# EAGLE design terrarium shield (EAGLE 6.5.0)
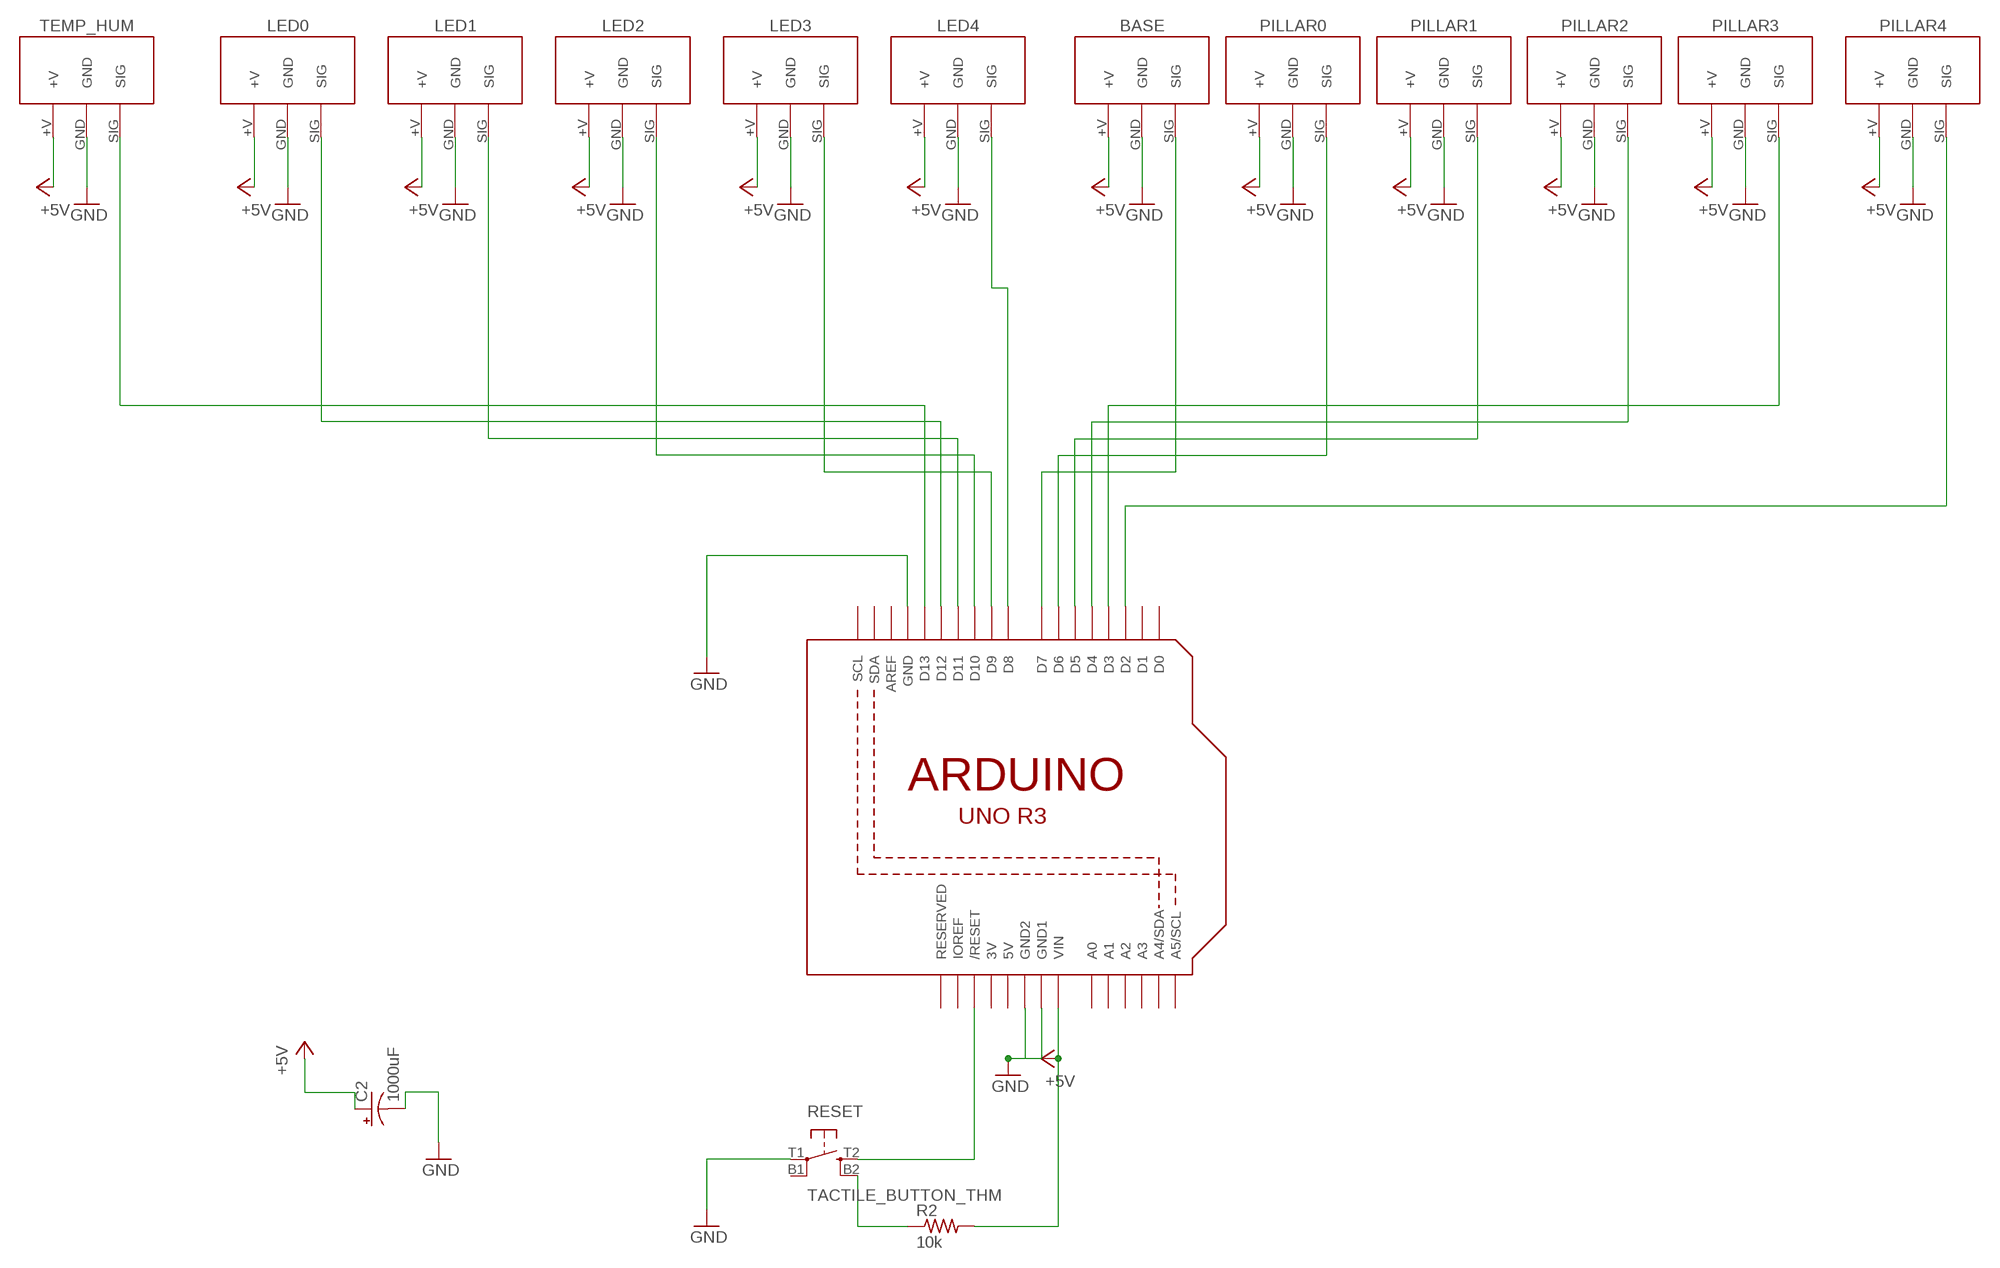
[diagram p0: schematic, sheet 1]

## Parts
BASE  MOLEX_3PIN_VERT_THM  [MOLEX_3PIN_VERT_THM]
C2  1000uF  CAP_POLPTH4  [CPOL-RADIAL-1000UF-25V]
LED0  MOLEX_3PIN_VERT_THM  [MOLEX_3PIN_VERT_THM]
LED1  MOLEX_3PIN_VERT_THM  [MOLEX_3PIN_VERT_THM]
LED2  MOLEX_3PIN_VERT_THM  [MOLEX_3PIN_VERT_THM]
LED3  MOLEX_3PIN_VERT_THM  [MOLEX_3PIN_VERT_THM]
LED4  MOLEX_3PIN_VERT_THM  [MOLEX_3PIN_VERT_THM]
PILLAR0  MOLEX_3PIN_VERT_THM  [MOLEX_3PIN_VERT_THM]
PILLAR1  MOLEX_3PIN_VERT_THM  [MOLEX_3PIN_VERT_THM]
PILLAR2  MOLEX_3PIN_VERT_THM  [MOLEX_3PIN_VERT_THM]
PILLAR3  MOLEX_3PIN_VERT_THM  [MOLEX_3PIN_VERT_THM]
PILLAR4  MOLEX_3PIN_VERT_THM  [MOLEX_3PIN_VERT_THM]
R2  10k  RESISTOR_US_THM  [RESISTOR_THM]
RESET  TACTILE_BUTTON_THM  [TACTILE_BUTTON_THM]
TEMP_HUM  MOLEX_3PIN_VERT_THM  [MOLEX_3PIN_VERT_THM]
U$1  ARDUINO_UNO_R3  [ARDUINO_UNO_R3]

## Nets
+5V [power]: BASE.+V C2.1(+) LED0.+V LED1.+V LED2.+V LED3.+V LED4.+V PILLAR0.+V PILLAR1.+V PILLAR2.+V PILLAR3.+V PILLAR4.+V R2.P$2 TEMP_HUM.+V U$1.VIN
GND [power]: BASE.GND C2.2(-) LED0.GND LED1.GND LED2.GND LED3.GND LED4.GND PILLAR0.GND PILLAR1.GND PILLAR2.GND PILLAR3.GND PILLAR4.GND RESET.T1 TEMP_HUM.GND U$1.GND U$1.GND1 U$1.GND2
N$1: R2.P$1 RESET.B2
N$2: TEMP_HUM.SIG U$1.D13
N$3: LED0.SIG U$1.D12
N$4: LED1.SIG U$1.D11
N$5: LED2.SIG U$1.D10
N$6: LED3.SIG U$1.D9
N$7: LED4.SIG U$1.D8
N$8: BASE.SIG U$1.D7
N$9: PILLAR0.SIG U$1.D6
N$10: PILLAR1.SIG U$1.D5
N$11: PILLAR2.SIG U$1.D4
N$12: PILLAR3.SIG U$1.D3
N$13: RESET.T2 U$1.RESET(/RESET)
N$15: PILLAR4.SIG U$1.D2
Unconnected: RESET.B1 U$1.A0 U$1.A1 U$1.A2 U$1.A3 U$1.A4(A4/SDA) U$1.A5(A5/SCL) U$1.AREF U$1.D0 U$1.D1 U$1.IOREF U$1.RESERVED U$1.SCL U$1.SDA

## Power pins joined to a net without a drawn wire
3V: U$1.3V
5V: U$1.5V

## Library data of the parts
BASE LED0 LED1-LED4 PILLAR0 PILLAR1-PILLAR4 TEMP_HUM = tjw:MOLEX_3PIN_VERT_THM: Starting on a device for the Molex 3pin vertical through-hole connectors I've ordered. Dimensions should be good, but pad placement just tossed in there.
C2 = SparkFun-Passives:CAP_POL: Capacitor Polarized These are standard SMD and PTH capacitors. Normally 10uF, 47uF, and 100uF in electrolytic and tantalum varieties. Always verify the external diameter of the through hole cap, it varies with capacity, voltage, and manufacturer. The EIA devices should be standard.
R2 = tjw:RESISTOR_US_THM: Basic through-hole resistor
RESET = tjw:TACTILE_BUTTON_THM
U$1 = tjw:ARDUINO_UNO_R3: Arduino Uno R3, copied from Adafruit library and border fixed to be in correct layer.

## Net classes
0 default: width 0.305 mm, drill 0.508 mm, clearance 0.305 mm
1 power: width 0.762 mm, drill 0.508 mm, clearance 0.508 mm

## Board
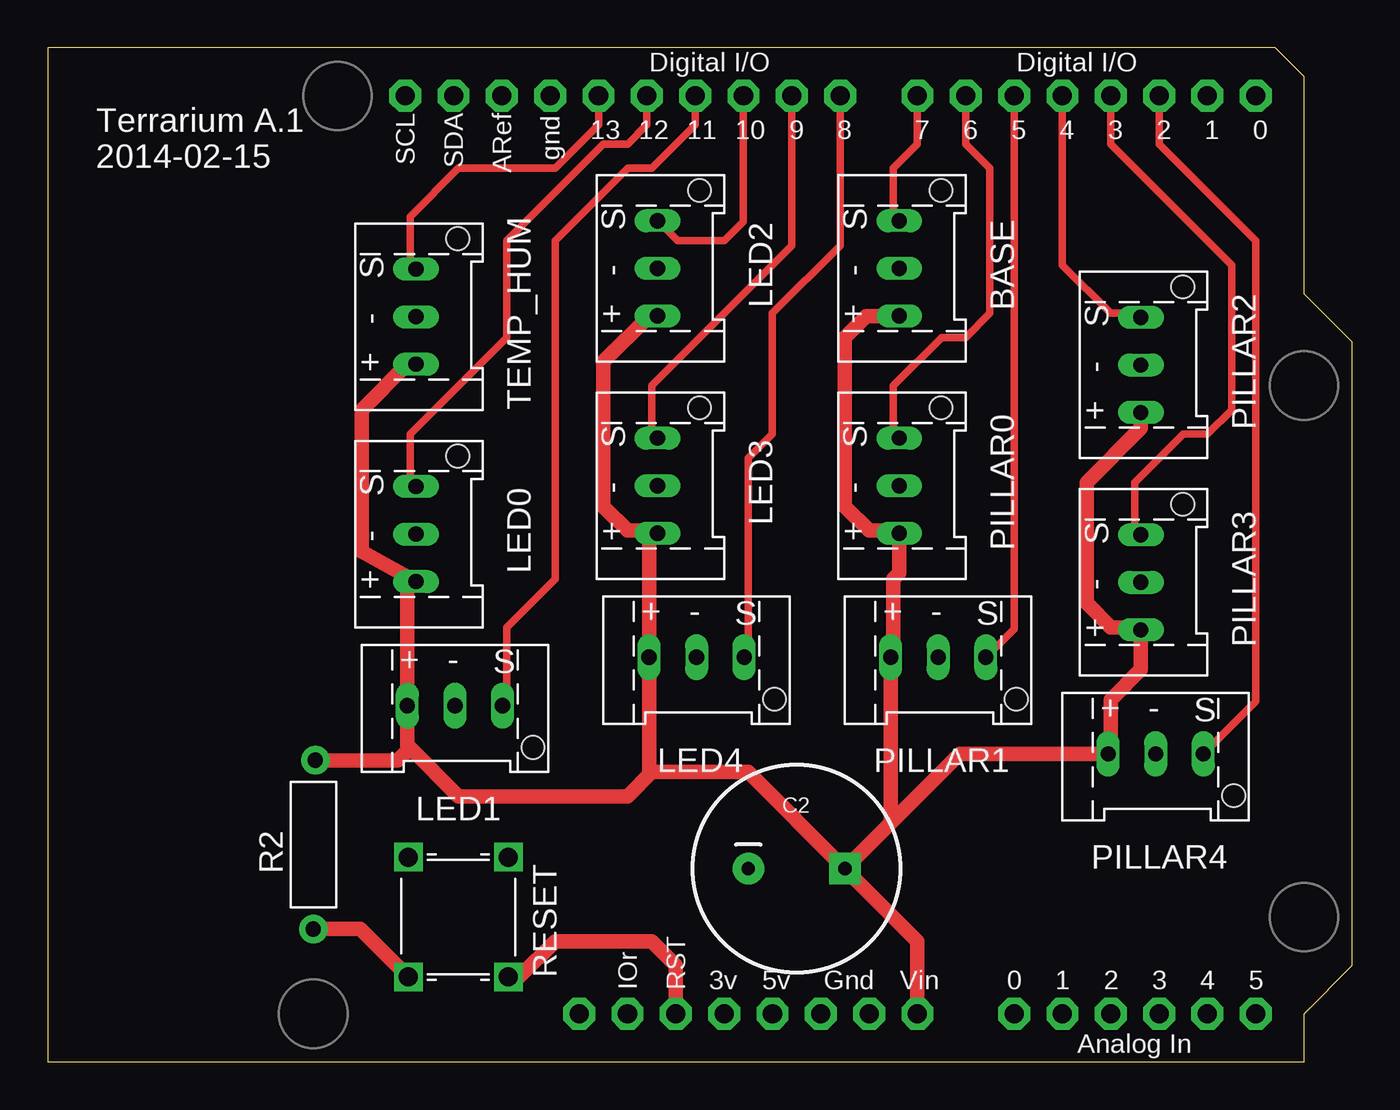
[diagram p1: board, top side]
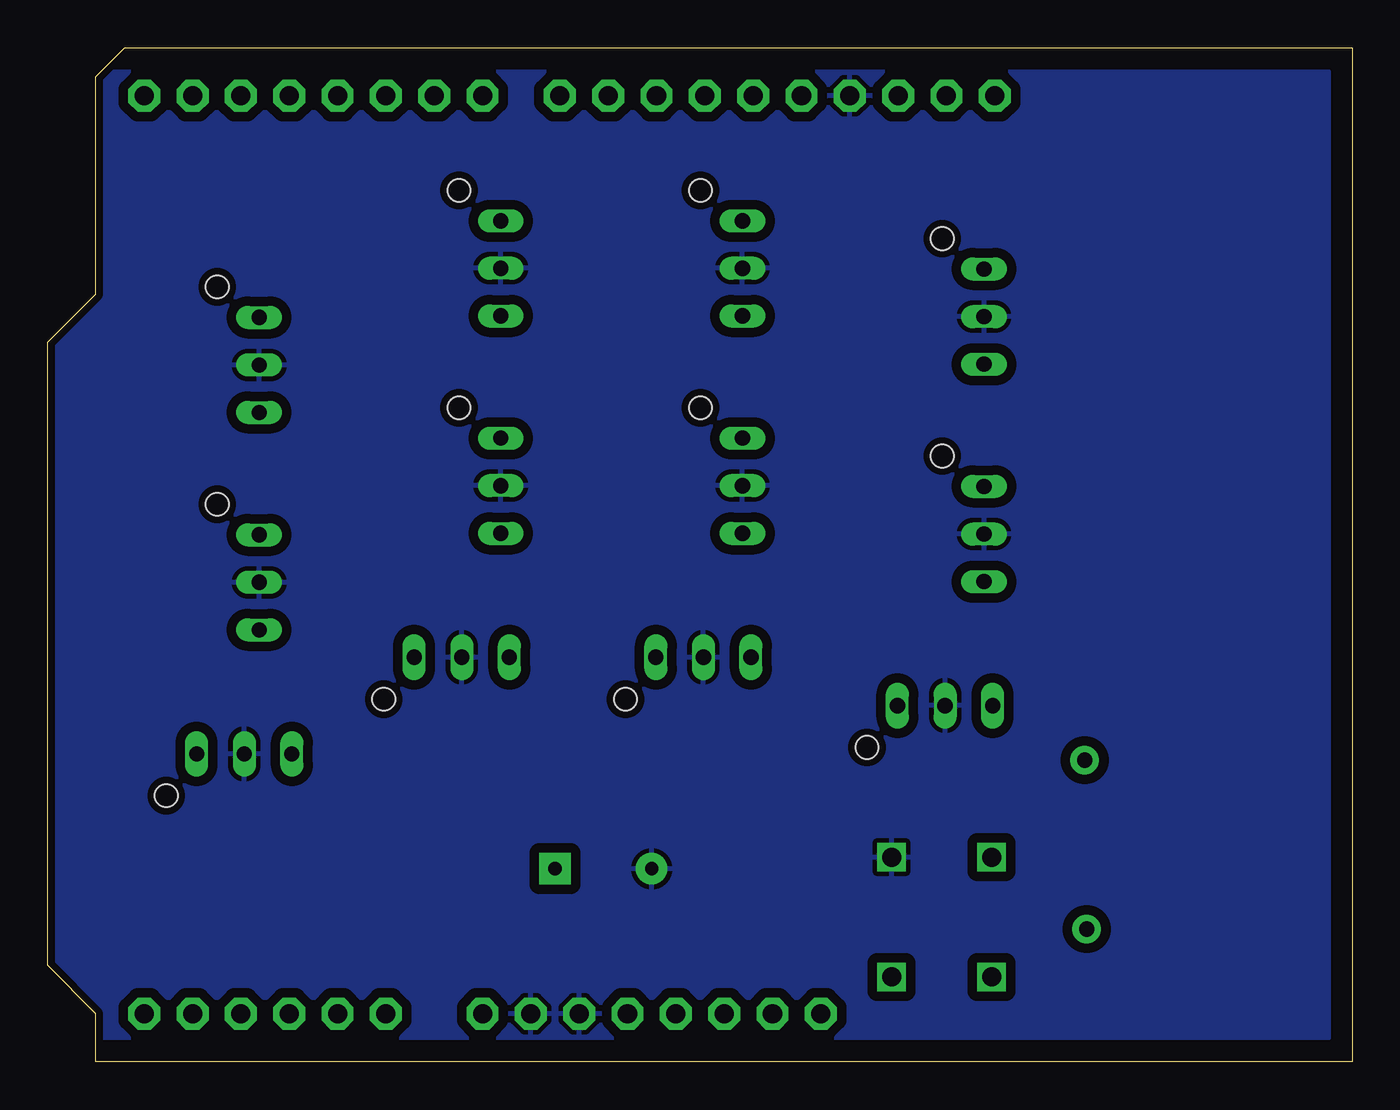
[diagram p2: board, bottom side, seen from below]

Size 68.58 x 53.34 mm. Coordinates in mm from the lower left corner, seen from the top.
Copper layers (1*16): Top 0.0356mm / dielectric 1.5011mm / Bottom 0.0356mm
Design rules "OSH Park": minimum track width 6mil, minimum drill 13mil, track to track 6mil, track to pad 6mil, pad to pad 6mil, via to via 6mil, smd to smd 6mil, copper to edge 15mil, drill to drill 6mil, minimum pad ring 7mil, minimum via ring 7mil, stop-mask expansion 3mil, vias tented up to drill 0mil, thermal gap 10mil

### Footprints (pad centres in the part's own frame; a part is rotated, then mirrored left to right if it is on the bottom)
MOLEX_3PIN_VERT_THM = drill 0.8 long: +V 2.4,3.5; GND 4.9,3.5; SIG 7.4,3.5 | hole 1.2: 9,1.3
CPOL-RADIAL-1000UF-25V = drill 0.7 pad 1.651 square: 1 2.54,0 | drill 0.7 pad 1.651: 2 -2.54,0
RESISTOR_THM = drill 0.8 pad 1.5: P$1 -4.44,0; P$2 4.44,-0.1
TACTILE_BUTTON_THM = drill 1 square: B1 -3.15,-2.625; B2 3.15,-2.625; T1 -3.15,2.625; T2 3.15,2.625
ARDUINO_UNO_R3 = drill 1 pad 1.676 octagon: 3V 35.56,2.54; 5V 38.1,2.54; A0 50.8,2.54; A1 53.34,2.54; A2 55.88,2.54; A3 58.42,2.54; A4 60.96,2.54; A5 63.5,2.54; AREF 23.876,50.8; D0 63.5,50.8; D1 60.96,50.8; D2 58.42,50.8; D3 55.88,50.8; D4 53.34,50.8; D5 50.8,50.8; D6 48.26,50.8; D7 45.72,50.8; D8 41.656,50.8; D9 39.116,50.8; D10 36.576,50.8; D11 34.036,50.8; D12 31.496,50.8; D13 28.956,50.8; GND 26.416,50.8; GND1 43.18,2.54; GND2 40.64,2.54; IOREF 30.48,2.54; RESERVED 27.94,2.54; RESET 33.02,2.54; SCL 18.796,50.8; SDA 21.336,50.8; VIN 45.72,2.54

### Placement (x,y rotation side)
BASE  48.26,36.83 90 top
C2  39.37,10.16 0 top
LED0  22.86,22.86 90 top
LED1  16.51,15.24 0 top
LED2  35.56,36.83 90 top
LED3  35.56,25.4 90 top
LED4  29.21,17.78 0 top
PILLAR0  48.26,25.4 90 top
PILLAR1  41.91,17.78 0 top
PILLAR2  60.96,31.75 90 top
PILLAR3  60.96,20.32 90 top
PILLAR4  53.34,12.7 0 top
R2  13.97,11.43 90 top
RESET  21.59,7.62 270 top
TEMP_HUM  22.86,34.29 90 top
U$1  0,0 0 top

### Tracks (layer width: path | path; a pad name or v marks a point on that pad's centre or on a via)
+5V
  Top 0.762: U$1.VIN 45.72,6.35 C2.1 | LED2.+V 31.61,39.23 29.21,36.83 29.21,29.21 30.48,27.94 31.92,27.94 LED3.+V 31.61,27.35 LED4.+V 31.61,15.38 31.75,15.24 | 44.45,12.7 44.31,12.84 PILLAR1.+V 44.45,21.42 44.45,25.4 44.76,25.71 PILLAR0.+V 44.62,27.94 43.18,27.94 41.91,29.21 41.91,38.1 43.04,39.23 BASE.+V | 44.45,12.7 C2.1 | 44.45,12.7 47.95,16.2 PILLAR4.+V 55.88,16.34 55.88,19.05 57.46,20.63 PILLAR3.+V 57.32,22.86 55.88,22.86 54.61,24.13 54.61,30.48 57.46,33.33 PILLAR2.+V | TEMP_HUM.+V 18.91,36.69 16.51,34.29 16.51,26.84 LED0.+V 18.91,24.81 LED1.+V 18.91,16.65 19.05,16.51 | 31.75,15.24 36.83,15.24 C2.1 | 19.05,16.51 21.59,13.97 30.48,13.97 31.75,15.24 | R2.P$2 18.41,15.87 19.05,16.51
GND
  pour Bottom: 1.27,52.07 1.27,1.27 68.58,1.27 68.58,52.07
N$1
  Top 0.762: R2.P$1 16.45,6.99 RESET.B2
N$2
  Top 0.406: U$1.D13 28.96,49.28 26.67,46.99 21.59,46.99 19.05,44.45 19.05,42 TEMP_HUM.SIG
N$3
  Top 0.406: U$1.D12 31.5,49.28 30.48,48.26 29.21,48.26 24.13,43.18 24.13,38.1 19.05,33.02 19.05,30.57 LED0.SIG
N$4
  Top 0.406: U$1.D11 34.04,49.28 31.75,46.99 30.48,46.99 26.67,43.18 26.67,25.4 24.13,22.86 24.13,18.96 LED1.SIG
N$5
  Top 0.406: U$1.D10 36.58,44.2 35.56,43.18 33.11,43.18 LED2.SIG
N$6
  Top 0.406: U$1.D9 39.12,42.93 31.75,35.56 31.75,33.11 LED3.SIG
N$7
  Top 0.406: U$1.D8 41.66,42.93 38.1,39.37 38.1,33.02 36.83,31.75 36.83,21.5 LED4.SIG
N$8
  Top 0.406: U$1.D7 45.72,48.26 44.45,46.99 44.45,44.54 BASE.SIG
N$9
  Top 0.406: U$1.D6 48.26,48.26 49.53,46.99 49.53,39.37 48.26,38.1 46.99,38.1 44.45,35.56 44.45,33.11 PILLAR0.SIG
N$10
  Top 0.406: U$1.D5 50.8,22.77 PILLAR1.SIG
N$11
  Top 0.406: U$1.D4 53.34,41.91 55.88,39.37 57.24,39.37 PILLAR2.SIG
N$12
  Top 0.406: U$1.D3 55.88,48.26 62.23,41.91 62.23,34.29 60.96,33.02 59.69,33.02 57.15,30.48 57.15,28.03 PILLAR3.SIG
N$13
  Top 0.762: RESET.T2 24.79,4.47 26.67,6.35 31.75,6.35 33.02,5.08 U$1.RESET
N$15
  Top 0.406: U$1.D2 58.42,48.26 63.5,43.18 63.5,18.96 PILLAR4.SIG

### Text on the board
tNames: Terrarium A.1 / 2014-02-15